# Altium schematic sheet Sonar_Sheet1.SchDoc
size A4; SheetNumber: 1; SheetTotal: 1
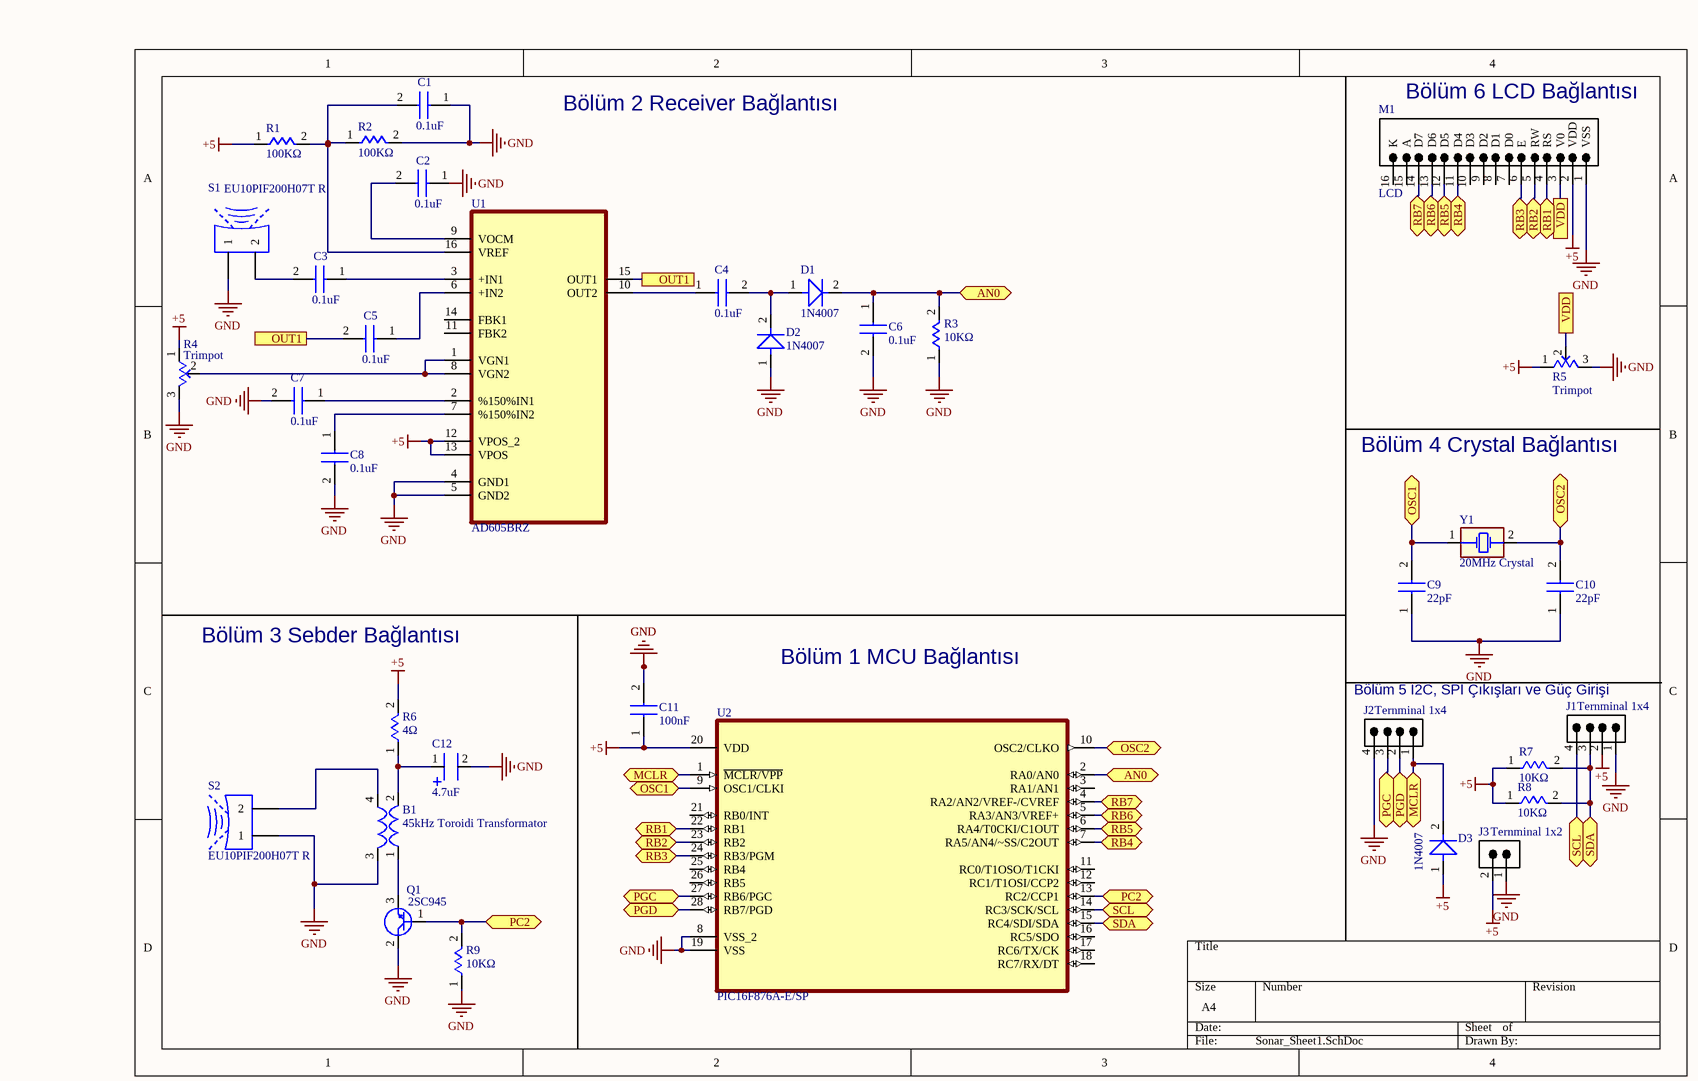
[diagram p0: Sonar_Sheet1.SchDoc]

## Parts
B1  45kHz Toroidi Transformator  [Toroidi Transformator]
C1  0.1uF  [CAP]
C2  0.1uF  [CAP]
C3  0.1uF  [CAP]
C4  0.1uF  [CAP]
C5  0.1uF  [CAP]
C6  0.1uF  [CAP]
C7  0.1uF  [CAP]
C8  0.1uF  [CAP]
C9  22pF  [CAP]
C10  22pF  [CAP]
C11  100nF  [CAP]
C12  4.7uF  [CAP POL]
D1  1N4007  [Diode]
D2  1N4007  [Diode]
D3  1N4007  [Diode]
J1  Ternminal 1x4  [Terminal 1x4]
J2  Ternminal 1x4  [Terminal 1x4]
J3  Ternminal 1x2  [Terminal 1x2]
M1  LCD  [LCD]
Q1  2SC945  [2SC945]
R1  100KΩ  [Res]
R2  100KΩ  [Res]
R3  10KΩ  [Res]
R4  Trimpot  [Trimpot]
R5  Trimpot  [Trimpot]
R6  4Ω  [Res]
R7  10KΩ  [Res]
R8  10KΩ  [Res]
R9  10KΩ  [Res]
S1  EU10PIF200H07T R  [EU10PIF200H07T R]
S2  EU10PIF200H07T R  [EU10PIF200H07T R]
U1  AD605BRZ  [SOIC127P600X175-16N]
U2  PIC16F876A-E/SP  [DIP787W46P254L3467H508Q28]
Y1  20MHz Crystal  [Crystal]

## Ports
AN0 (bidir), MCLR (bidir), OSC1 (bidir), OSC2 (bidir), OUT1, PC2 (bidir), PGC (bidir), PGD (bidir), RB1 (bidir), RB2 (bidir), RB3 (bidir), RB4 (bidir), RB5 (bidir), RB6 (bidir), RB7 (bidir), SCL (bidir), SDA (bidir), VDD

## Nets
+5: C11.1 D3.1 J1.2 J3.2 M1.2(VDD) R1.1 R4.1 R5.1 R6.2 R7.1 R8.1 U1.12(VPOS_2) U1.13(VPOS) U2.20(VDD)
GND: B1.3 C1.1 C2.1 C6.2 C7.2 C8.2 C9.1 C10.1 C11.2 C12.2 D2.1 J1.1 J2.4 J3.1 M1.1(VSS) Q1.2 R2.2 R3.1 R4.3 R5.3 R9.1 S1.1 S2.1 U1.4(GND1) U1.5(GND2) U2.8(VSS_2) U2.19(VSS)
AN0: C6.1 D1.2 R3.2 U2.2(RA0/AN0) ; port AN0
MCLR: D3.2 J2.1 U2.1(~{MCLR/VPP}) ; port MCLR
OSC1: C9.2 U2.9(OSC1/CLKI) Y1.1 ; port OSC1
OSC2: C10.2 U2.10(OSC2/CLKO) Y1.2 ; port OSC2
OUT1: C5.2 U1.15(OUT1) ; port OUT1
PC2: Q1.1 R9.2 U2.13(RC2/CCP1) ; port PC2
PGC: J2.3 U2.27(RB6/PGC) ; port PGC
PGD: J2.2 U2.28(RB7/PGD) ; port PGD
RB1: M1.4(RS) U2.22(RB1) ; port RB1
RB2: M1.5(RW) U2.23(RB2) ; port RB2
RB3: M1.6(E) U2.24(RB3/PGM) ; port RB3
RB4: M1.11(D4) U2.7(RA5/AN4/~SS/C2OUT) ; port RB4
RB5: M1.12(D5) U2.6(RA4/T0CKI/C1OUT) ; port RB5
RB6: M1.13(D6) U2.5(RA3/AN3/VREF+) ; port RB6
RB7: M1.14(D7) U2.4(RA2/AN2/VREF-/CVREF) ; port RB7
SCL: J1.4 U2.14(RC3/SCK/SCL) ; port SCL
SDA: J1.3 R7.2 R8.2 U2.15(RC4/SDI/SDA) ; port SDA
VDD: M1.3(V0) R5.2 ; port VDD
NetB1_1: B1.1 Q1.3
NetB1_2: B1.2 C12.1 R6.1
NetB1_4: B1.4 S2.2
NetC1_2: C1.2 R1.2 R2.1 U1.16(VREF)
NetC2_2: C2.2 U1.9(VOCM)
NetC3_1: C3.1 U1.3(+IN1)
NetC3_2: C3.2 S1.2
NetC4_1: C4.1 U1.10(OUT2)
NetC4_2: C4.2 D1.1 D2.2
NetC5_1: C5.1 U1.6(+IN2)
NetC7_1: C7.1 U1.2(%150%IN1)
NetC8_1: C8.1 U1.7(%150%IN2)
NetR4_2: R4.2 U1.1(VGN1) U1.8(VGN2)

Not connected (* = marked no-connect by the designer): M1 7(D0) 8(D1) 9(D2) 10(D3) 15(A) 16(K); U1 11(FBK2) 14(FBK1); U2 3(RA1/AN1) 11(RC0/T1OSO/T1CKI) 12(RC1/T1OSI/CCP2) 16(RC5/SDO) 17(RC6/TX/CK) 18(RC7/RX/DT) 21(RB0/INT) 25(RB4) 26(RB5)

## Notes on the sheet
- Bölüm 2 Receiver Bağlantısı
- Bölüm 6 LCD Bağlantısı
- Bölüm 4 Crystal Bağlantısı
- Bölüm 3 Sebder Bağlantısı
- Bölüm 1 MCU Bağlantısı
- Bölüm 5 I2C, SPI Çıkışları ve Güç Girişi

## Library data of the parts
B1 = 45kHz Toroidi Transformator: Toroidi Transformator; ComponentLink1Description: Satın Alma Linki; ComponentLink2Description: Datasheet
C1-C11 = CAP: Capacitor; ComponentLink1Description: Satın Alma Linki; ComponentLink1URL: https://www.gittigidiyor.com/bilgisayar-tablet/10nf-0-01uf-250vac-15mm-polyester-kondansator_pdp_737477069?srsltid=AWLEVJz16SnKX2NDZaIIXPvCbCHJrqrlRK97N02d1jbI8tg-I79--aDE9LQ; ComponentLink2Description: Satın Alma Linki; ComponentLink2URL: https://www.gittigidiyor.com/bilgisayar-tablet/ero-0-1uf-100nf-104-63v-poly-kapasitor-1-adet-fiyatidir_pdp_567908829?srsltid=AWLEVJxjHrN956zYqkQJwJOlEd-L4Xspu9kCsmMCN64mFV4zCJysjyK6NUI; ComponentLink4Description: Satın Alma Linki; ComponentLink4URL: https://www.direnc.net/22-pf-63v-kondansator
  C1-C8: ComponentLink5Description: Satın Alma Linki; ComponentLink5URL: https://www.direnc.net/100nf-63v-seramik
C12 = Cap Pol: MZ1V687M12020PH - CAP.EL.680uF 35V 12.5x20 5MM 105C TB SAMWHA; ComponentLink1Description: Satın Alma Linki; ComponentLink1URL: https://www.robotistan.com/50v-47-uf-kondansator?language=tr&h=1c00dcc6&gclid=CjwKCAjw8sCRBhA6EiwA6_IF4VXoQwnzNkJJ9WqRPn2NBUHTJmkaiTyihiBkaYJlX-EbQcFZ5TCuURoCGtoQAvD_BwE
D1-D3 = 1N4007: 1N4007 Diyot - MIC; ComponentLink1Description: Satın Alma Linki; ComponentLink1URL: https://www.direnc.net/1n4007-diyot-mic?language=tr&h=be9c89b5; ComponentLink2Description: Datasheet; ComponentLink2URL: https://pdf.direnc.net/upload/1n4007-mic-datasheet.pdf
M1 = LCD: 2x16 LCD Ekran Sol Üst Mavi - Qapass; ComponentLink1Description: Satın Alma Linki; ComponentLink1URL: https://www.direnc.net/2x16-lcd-display-sol-ust-mavi-qapass
Q1 = 2SC945: 2SC945 Npn Tht Transistör To-92; ComponentLink1Description: Satın Alma Linki; ComponentLink1URL: https://www.direnc.net/2sc945-npn-transistor-to-92; ComponentLink2Description: Datasheet; ComponentLink2URL: https://pdf.direnc.net/upload/2sc945-datasheet.pdf
R1-R3 R6-R9 = RES: THT RES; ComponentLink1Description: Satın Alma Linki; ComponentLink1URL: https://www.direnc.net/100k-14w-direnc; ComponentLink2Description: Satın Alma Linki; ComponentLink2URL: https://www.direnc.net/10k-14w-direnc; ComponentLink3Description: Satın Alma Linki; ComponentLink3URL: https://www.direnc.net/330r-14w-direnc
R4 R5 = Trimpot: 10K Trimpot (Yatık) - PT10; ComponentLink1Description: Satın Alma Linki; ComponentLink1URL: https://www.robotistan.com/10k-trimpot-yatik-pt10; ComponentLink2Description: Datasheet; ComponentLink2URL: https://www.robotistan.com/10k-trimpot-yatik-pt10
S1 S2 = EU10PIF200H07T R: Suya Dayanıklı Ultrasonik Sensör RT Mesafe Ölçüm Probu - 10mm (EU10PIF200H07T R 200Khz); ComponentLink1Description: Satın Alma Linki; ComponentLink1URL: https://www.robotistan.com/suya-dayanikli-ultrasonik-sensor-10mm?language=tr&h=b3c9ab81; ComponentLink2Description: Datasheet; ComponentLink2URL: https://tr.aliexpress.com/item/33039788263.html?spm=a2g0o.productlist.0.0.66bc1f47oNyabD&algo_pvid=28f77d51-3c5b-4650-aee5-95afa2ae2236&algo_exp_id=28f77d51-3c5b-4650-aee5-95afa2ae2236-42&pdp_ext_f=%7B%22sku_id%22%3A%2267411356863%22%7D&pdp_pi=-1%3B17.15%3B-1%3B-1%40salePrice%3BTRY%3Bsearch-mainSearch
U1 = AD605BRZ: SP Amp Variable Gain Amp Dual 5.5V 16-Pin SOIC N Tube; MF: Analog Devices; Check_prices: https://www.snapeda.com/parts/AD605BRZ/Analog+Devices+Inc./view-part/?ref=eda; Purchase-URL: https://pricing.snapeda.com/search/part/AD605BRZ/?ref=eda; Value: *; MP: AD605BRZ; SnapEDA_Link: https://www.snapeda.com/parts/AD605BRZ/Analog+Devices+Inc./view-part/?ref=snap; Availability: In Stock; Price: None; Package: SOIC-16 Analog Devices; ComponentLink1Description: Satın Alma Linki; ComponentLink1URL: https://karakoyelektronik.com/entegre-opamp/ad605arz-ad605-soic-16-smd-entegre-73227; ComponentLink2Description: Datasheet; ComponentLink2URL: https://www.analog.com/media/en/technical-documentation/data-sheets/ad605.pdf
U2 = PIC16F876A-E/SP: PIC PICÂ® 16F Microcontroller IC 8-Bit 20MHz 14KB _8K x 14_ FLASH 28-SPDIP; MF: Microchip; Price: None; SnapEDA_Link: https://www.snapeda.com/parts/PIC16F876A-E/SP/Microchip/view-part/39708/?ref=snap; MP: PIC16F876A-E/SP; Availability: Unavailable; Value: *; Package: SPDIP-28 Microchip
Y1 = 20MHz Crystal: 20.000 MHz Kristal HC-49S; ComponentLink1Description: Satın Alma Linki; ComponentLink1URL: https://www.direnc.net/20000mhz-kristal-hc-49s; ComponentLink2Description: Datasheet; ComponentLink2URL: https://pdf.direnc.net/upload/hc-49s-datasheet.pdf
J1 J2 = Ternminal 1x4: ComponentLink1Description: Satın Alma Linki; ComponentLink2Description: Datasheet
J3 = Ternminal 1x2: ComponentLink1Description: Satın Alma Linki; ComponentLink2Description: Datasheet